# EAGLE design board (EAGLE 9.2.2)
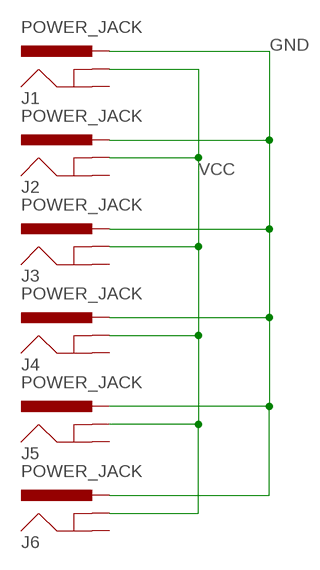
[diagram p0: schematic, sheet 1]

## Parts
J1  POWER_JACK  [POWER_JACK_PTH]
J2  POWER_JACK  [POWER_JACK_PTH]
J3  POWER_JACK  [POWER_JACK_PTH]
J4  POWER_JACK  [POWER_JACK_PTH]
J5  POWER_JACK  [POWER_JACK_PTH]
J6  POWER_JACK  [POWER_JACK_PTH]

## Nets
GND: J1.PWR J2.PWR J3.PWR J4.PWR J5.PWR J6.PWR
VCC: J1.GNDBREAK J2.GNDBREAK J3.GNDBREAK J4.GNDBREAK J5.GNDBREAK J6.GNDBREAK
Unconnected: J1.GND J2.GND J3.GND J4.GND J5.GND J6.GND

## Library data of the parts
J1-J6 = simple-shiled:POWER_JACK: Power Jack Connector This is the standard 5.5mm barrel jack for power. The PTH is the most common, proven, reliable, footprint. The Slot footprint only works if the mill layer is transmitted to the PCB fab house so be warned. Here are the connectors we sell at SparkFun: DC Barrel Power Jack/Connector <https://www.sparkfun.com/products/119> (PRT-00119) DC Barrel Power Jack/Connector (SMD) <https://www.sparkfun.com/products/12748> (PRT-12748) DC Barrel Jack Adapter - Breadboard Compatible <https://www.sparkfun.com/products/10811> (PRT-10811) It is used on this SparkFun product (and many, many others): SparkFun RedBoard - Programmed with Arduino <https://www.sparkfun.com/products/12757> (DEV-12757) Also, if you need a mating power supply or connector, please check these out: Wall Adapter Power Supply - 9VDC 650mA <https://www.sparkfun.com/products/298> (TOL-00298) DC Barrel Jack Adapter - Male <https://www.sparkfun.com/products/10287> (PRT-10287); PROD_ID: CONN-08197

## Board
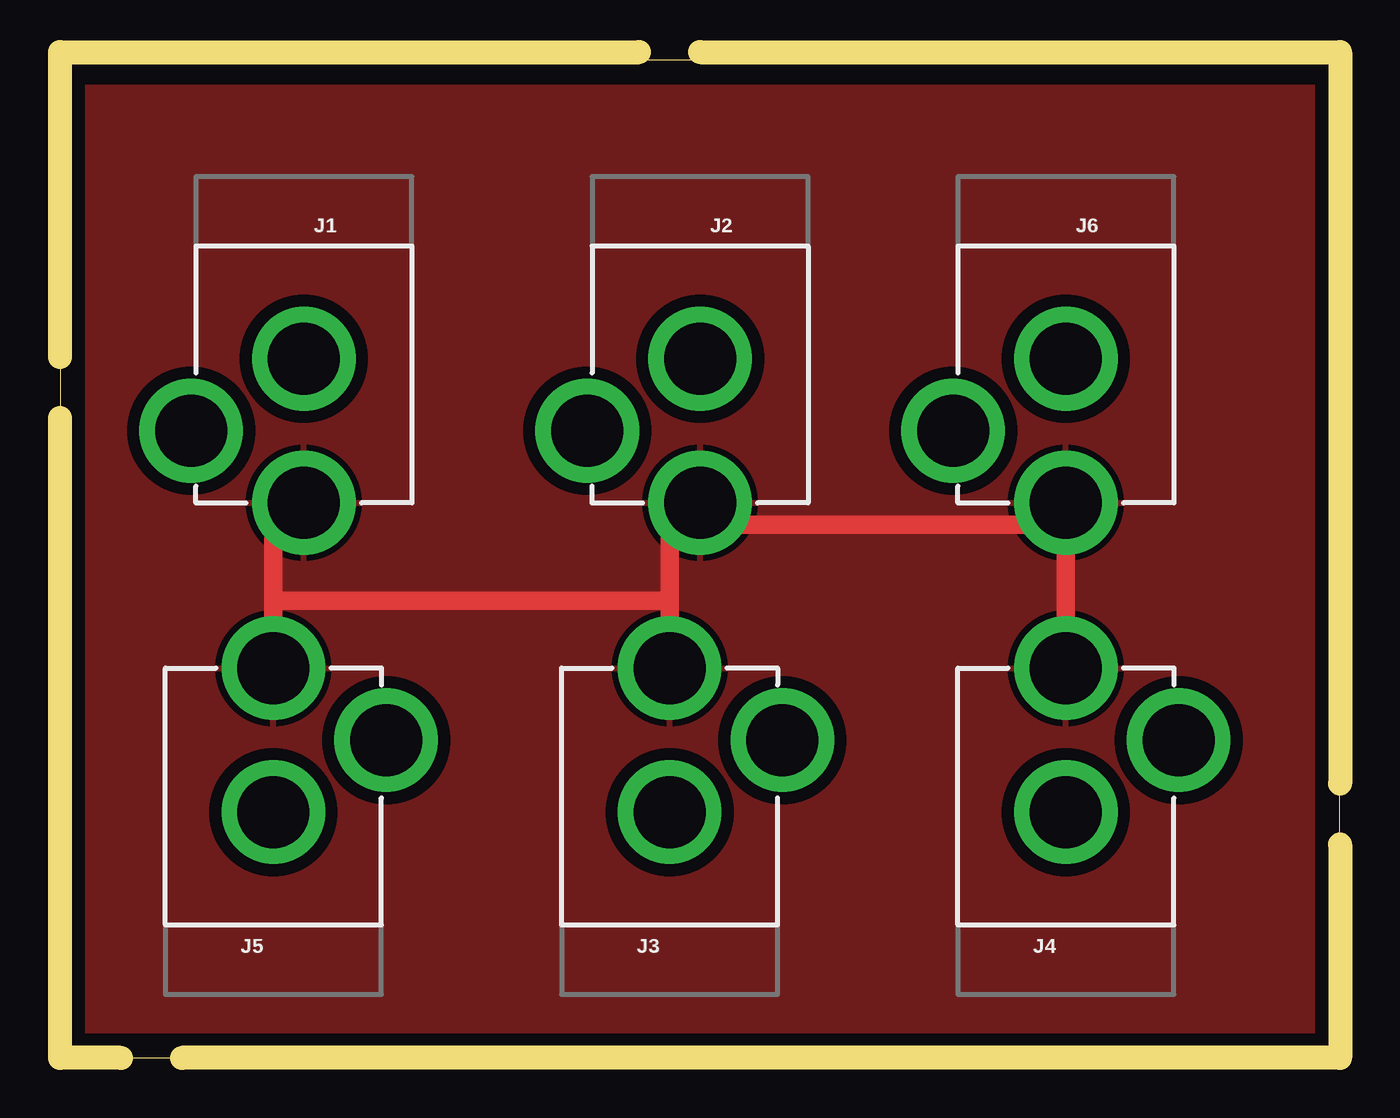
[diagram p1: board, top side]
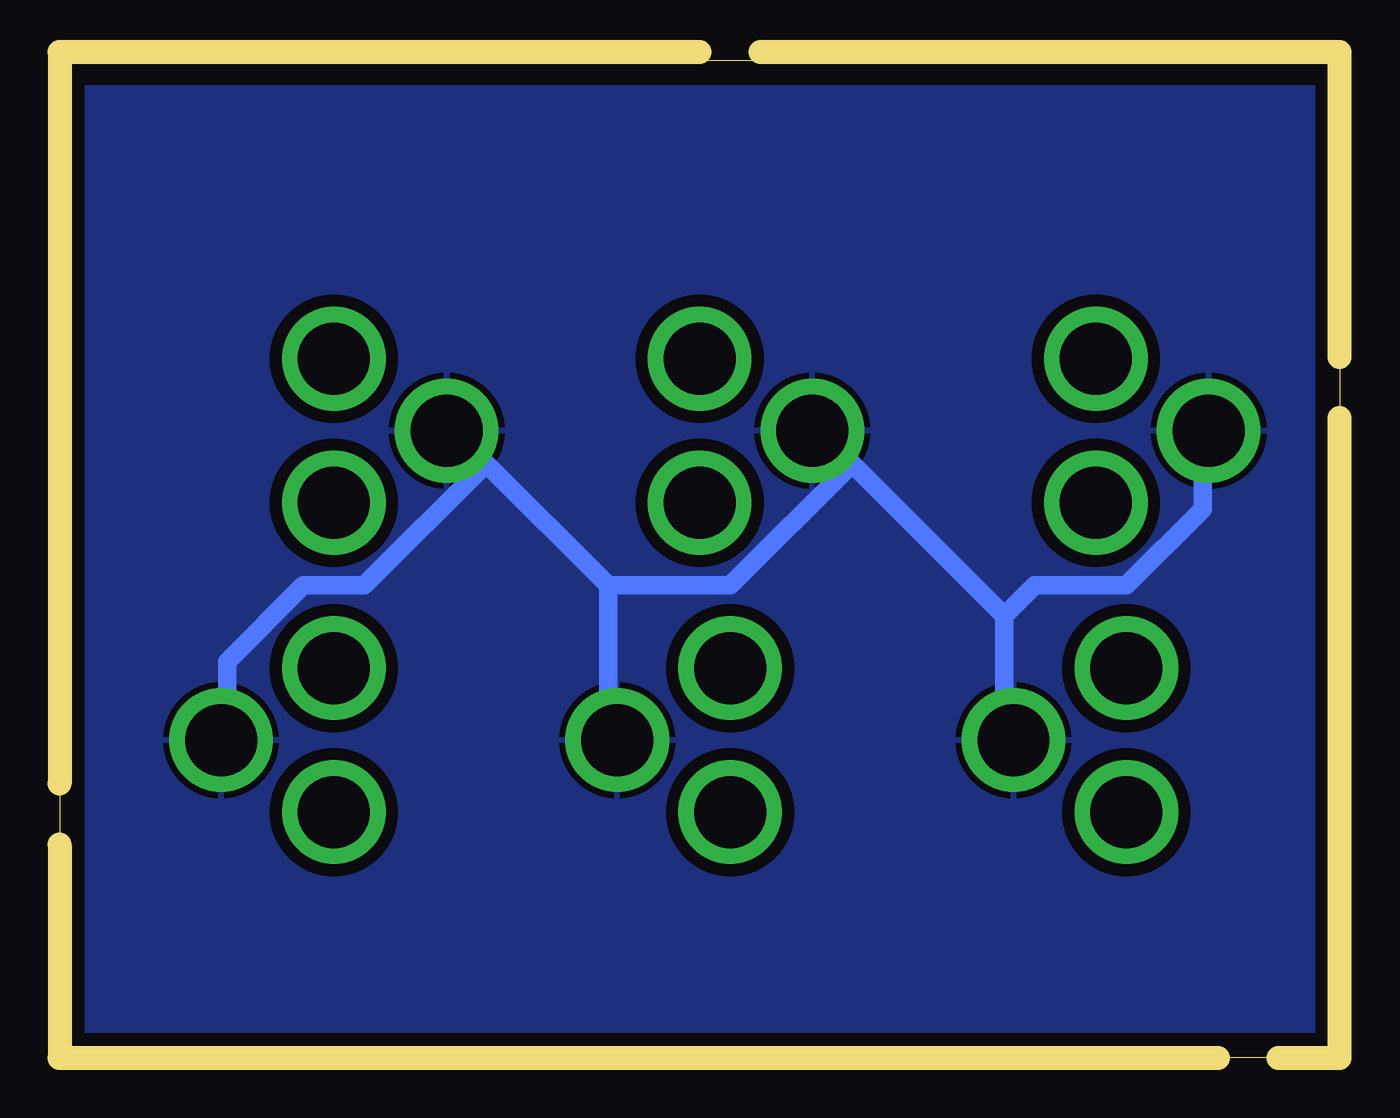
[diagram p2: board, bottom side, seen from below]

Size 53.32 x 41.58 mm. Coordinates in mm from the lower left corner, seen from the top.
Outline: 0,0 53.32,0 53.32,41.58 0,41.58 0,0
Copper layers (1*16): Top 0.035mm / dielectric 1.5mm / Bottom 0.035mm
Design rules "default *": minimum track width 30mil, minimum drill 0.35mm, track to track 20mil, track to pad 30mil, pad to pad 30mil, via to via 6mil, smd to smd 6mil, copper to edge 40mil, drill to drill 6mil, minimum pad ring 10mil, minimum via ring 8mil, stop-mask expansion 4mil, vias tented up to drill 0mil, thermal gap 10mil
Milling: 8 lines

### Footprints (pad centres in the part's own frame; a part is rotated, then mirrored left to right if it is on the bottom)
POWER_JACK_PTH = drill 2.997 pad 4.318: GND 0,7.7; GNDBREAK 4.7,10.7; PWR 0,13.7

### Placement (x,y rotation side)
J1  10.16,36.83 180 top
J2  26.67,36.83 180 top
J3  25.4,2.54 0 top
J4  41.91,2.54 0 top
J5  8.89,2.54 0 top
J6  41.91,36.83 180 top

### Tracks (layer width: path | path; a pad name or v marks a point on that pad's centre or on a via)
GND
  Top 0.762: 8.89,19.05 8.89,21.59 10.16,22.86 J1.PWR | 8.89,19.05 J5.PWR | J6.PWR 41.91,22.23 | 41.91,22.23 J4.PWR | 25.4,19.05 25.4,21.59 26.04,22.23 | 25.4,19.05 J3.PWR | 26.04,22.23 26.67,22.86 J2.PWR 26.04,22.23 | 26.04,22.23 41.91,22.23 | 25.4,19.05 8.89,19.05
  pour Top: 0,41.91 0,0 53.34,0 53.34,41.91
VCC
  Bottom 0.762: 13.97,18.41 13.97,13.34 J5.GNDBREAK | 20.32,24.77 21.59,26.04 J2.GNDBREAK 20.32,24.77 | 20.32,24.77 13.97,18.41 | 13.97,18.41 12.7,19.68 8.89,19.68 5.71,22.86 5.71,26.04 J1.GNDBREAK | 30.48,19.68 30.48,13.34 J3.GNDBREAK | 35.56,24.77 36.83,26.04 J6.GNDBREAK 35.56,24.77 | 35.56,24.77 30.48,19.68 | 35.56,24.77 40.64,19.68 43.18,19.68 46.35,16.51 46.35,13.34 J4.GNDBREAK | 20.32,24.77 25.4,19.68 30.48,19.68
  pour Bottom: 0,41.91 0,0 53.34,0 53.34,41.91